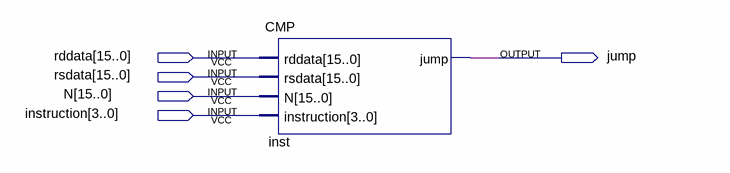
[diagram p0: schematic sheet]
// Quartus schematic test_CMP.bdf as structural Verilog: 1 symbols, 5 pins
module test_CMP (
  input  [15:0] rddata,
  input  [15:0] rsdata,
  input  [15:0] N,
  input  [3:0] instruction,
  output jump
);

  CMP inst (.rddata(rddata), .rsdata(rsdata), .N(N), .instruction(instruction), .jump(jump));
endmodule
